# EAGLE design beaglebone_rotor_control_cape (EAGLE 6.5.0)

## Sheet 1 of 7
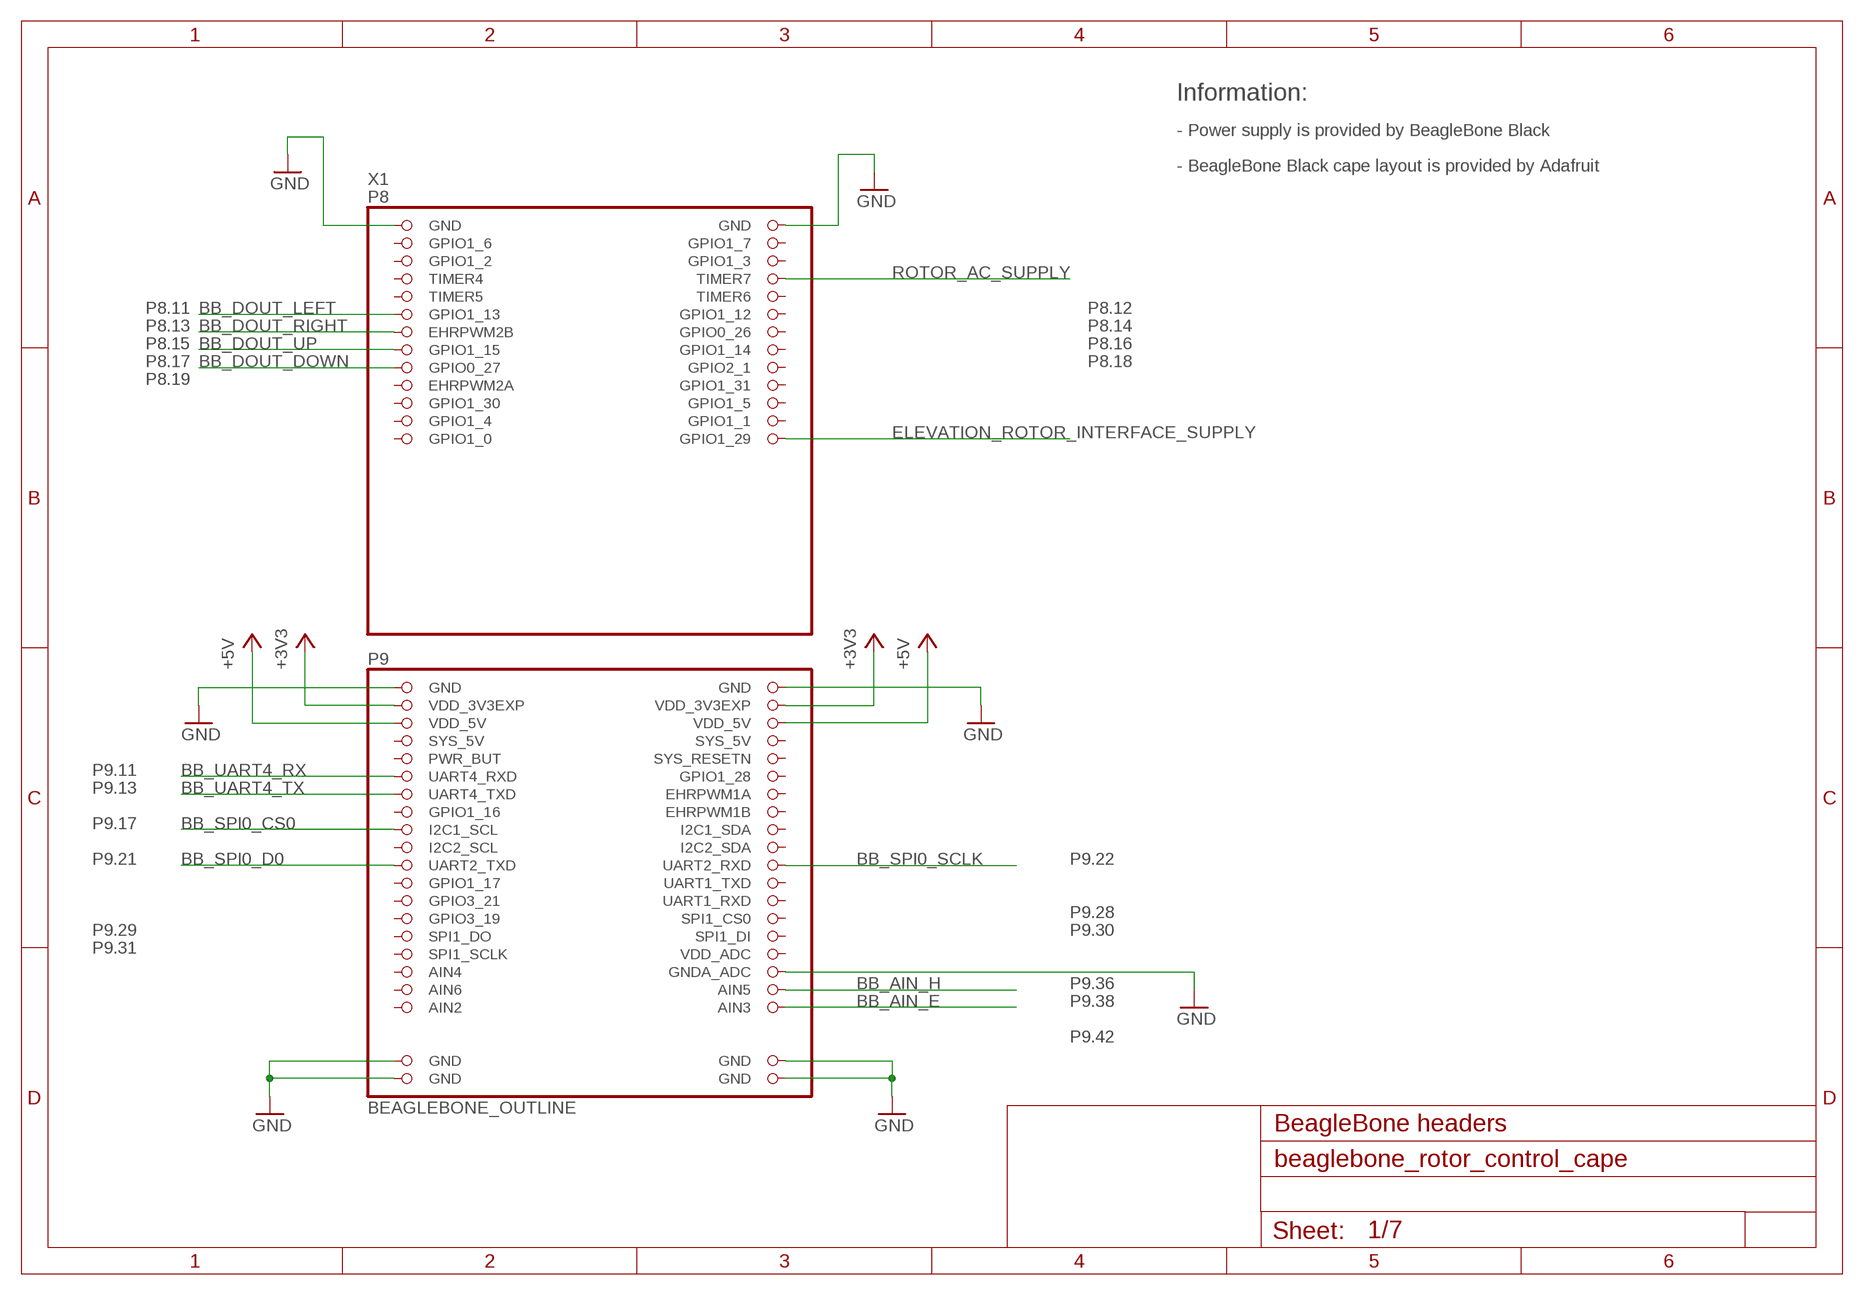
[diagram p0: schematic, sheet 1]

### Parts
X1  BEAGLEBONE_OUTLINE  [BEAGLEBONE_SHIELD]

### Nets
+3V3: X1.49(VDD_3V3EXP) X1.50(VDD_3V3EXP) ; also sheet 2,7
+5V: X1.51(VDD_5V) X1.52(VDD_5V) ; also sheet 2,3,5,6
BB_AIN_E: X1.84(AIN3) ; also sheet 3
BB_AIN_H: X1.82(AIN5) ; also sheet 2
BB_DOUT_DOWN: X1.17(GPIO0_27) ; also sheet 3
BB_DOUT_LEFT: X1.11(GPIO1_13) ; also sheet 2
BB_DOUT_RIGHT: X1.13(EHRPWM2B) ; also sheet 2
BB_DOUT_UP: X1.15(GPIO1_15) ; also sheet 3
BB_SPI0_CS0: X1.63(I2C1_SCL) ; also sheet 2
BB_SPI0_D0: X1.67(UART2_TXD) ; also sheet 2
BB_SPI0_SCLK: X1.68(UART2_RXD) ; also sheet 2
BB_UART4_RX: X1.57(UART4_RXD) ; also sheet 7
BB_UART4_TX: X1.59(UART4_TXD) ; also sheet 7
ELEVATION_ROTOR_INTERFACE_SUPPLY: X1.26(GPIO1_29) ; also sheet 6
GND: X1.1(GND) X1.2(GND) X1.47(GND) X1.48(GND) X1.80(GNDA_ADC) X1.89(GND) X1.90(GND) X1.91(GND) X1.92(GND) ; also sheet 2,3,4,5,6,7
ROTOR_AC_SUPPLY: X1.8(TIMER7) ; also sheet 5
Unconnected: X1.3(GPIO1_6) X1.4(GPIO1_7) X1.5(GPIO1_2) X1.6(GPIO1_3) X1.7(TIMER4) X1.9(TIMER5) X1.10(TIMER6) X1.12(GPIO1_12) X1.14(GPIO0_26) X1.16(GPIO1_14) X1.18(GPIO2_1) X1.19(EHRPWM2A) X1.20(GPIO1_31) X1.21(GPIO1_30) X1.22(GPIO1_5) X1.23(GPIO1_4) X1.24(GPIO1_1) X1.25(GPIO1_0) X1.54(SYS_5V) X1.55(PWR_BUT) X1.56(SYS_RESETN) X1.58(GPIO1_28) X1.60(EHRPWM1A) X1.61(GPIO1_16) X1.62(EHRPWM1B) X1.64(I2C1_SDA) X1.65(I2C2_SCL) X1.66(I2C2_SDA) X1.69(GPIO1_17) X1.70(UART1_TXD) X1.71(GPIO3_21) X1.72(UART1_RXD) X1.73(GPIO3_19) X1.74(SPI1_CS0) X1.75(SPI1_DO) X1.76(SPI1_DI) X1.77(SPI1_SCLK) X1.78(VDD_ADC) X1.79(AIN4) X1.81(AIN6) X1.83(AIN2)

### Notes on the sheet
- Information:
- - Power supply is provided by BeagleBone Black
- - BeagleBone Black cape layout is provided by Adafruit
- P8.11 | P8.12
- P8.13 | P8.14
- P8.15 | P8.16
- P8.17 | P8.18
- P8.19
- P9.11
- P9.13
- P9.17
- P9.21 | P9.22
- P9.28
- P9.29 | P9.30
- P9.31
- P9.36
- P9.38
- P9.42
- BeagleBone headers

## Sheet 2 of 7
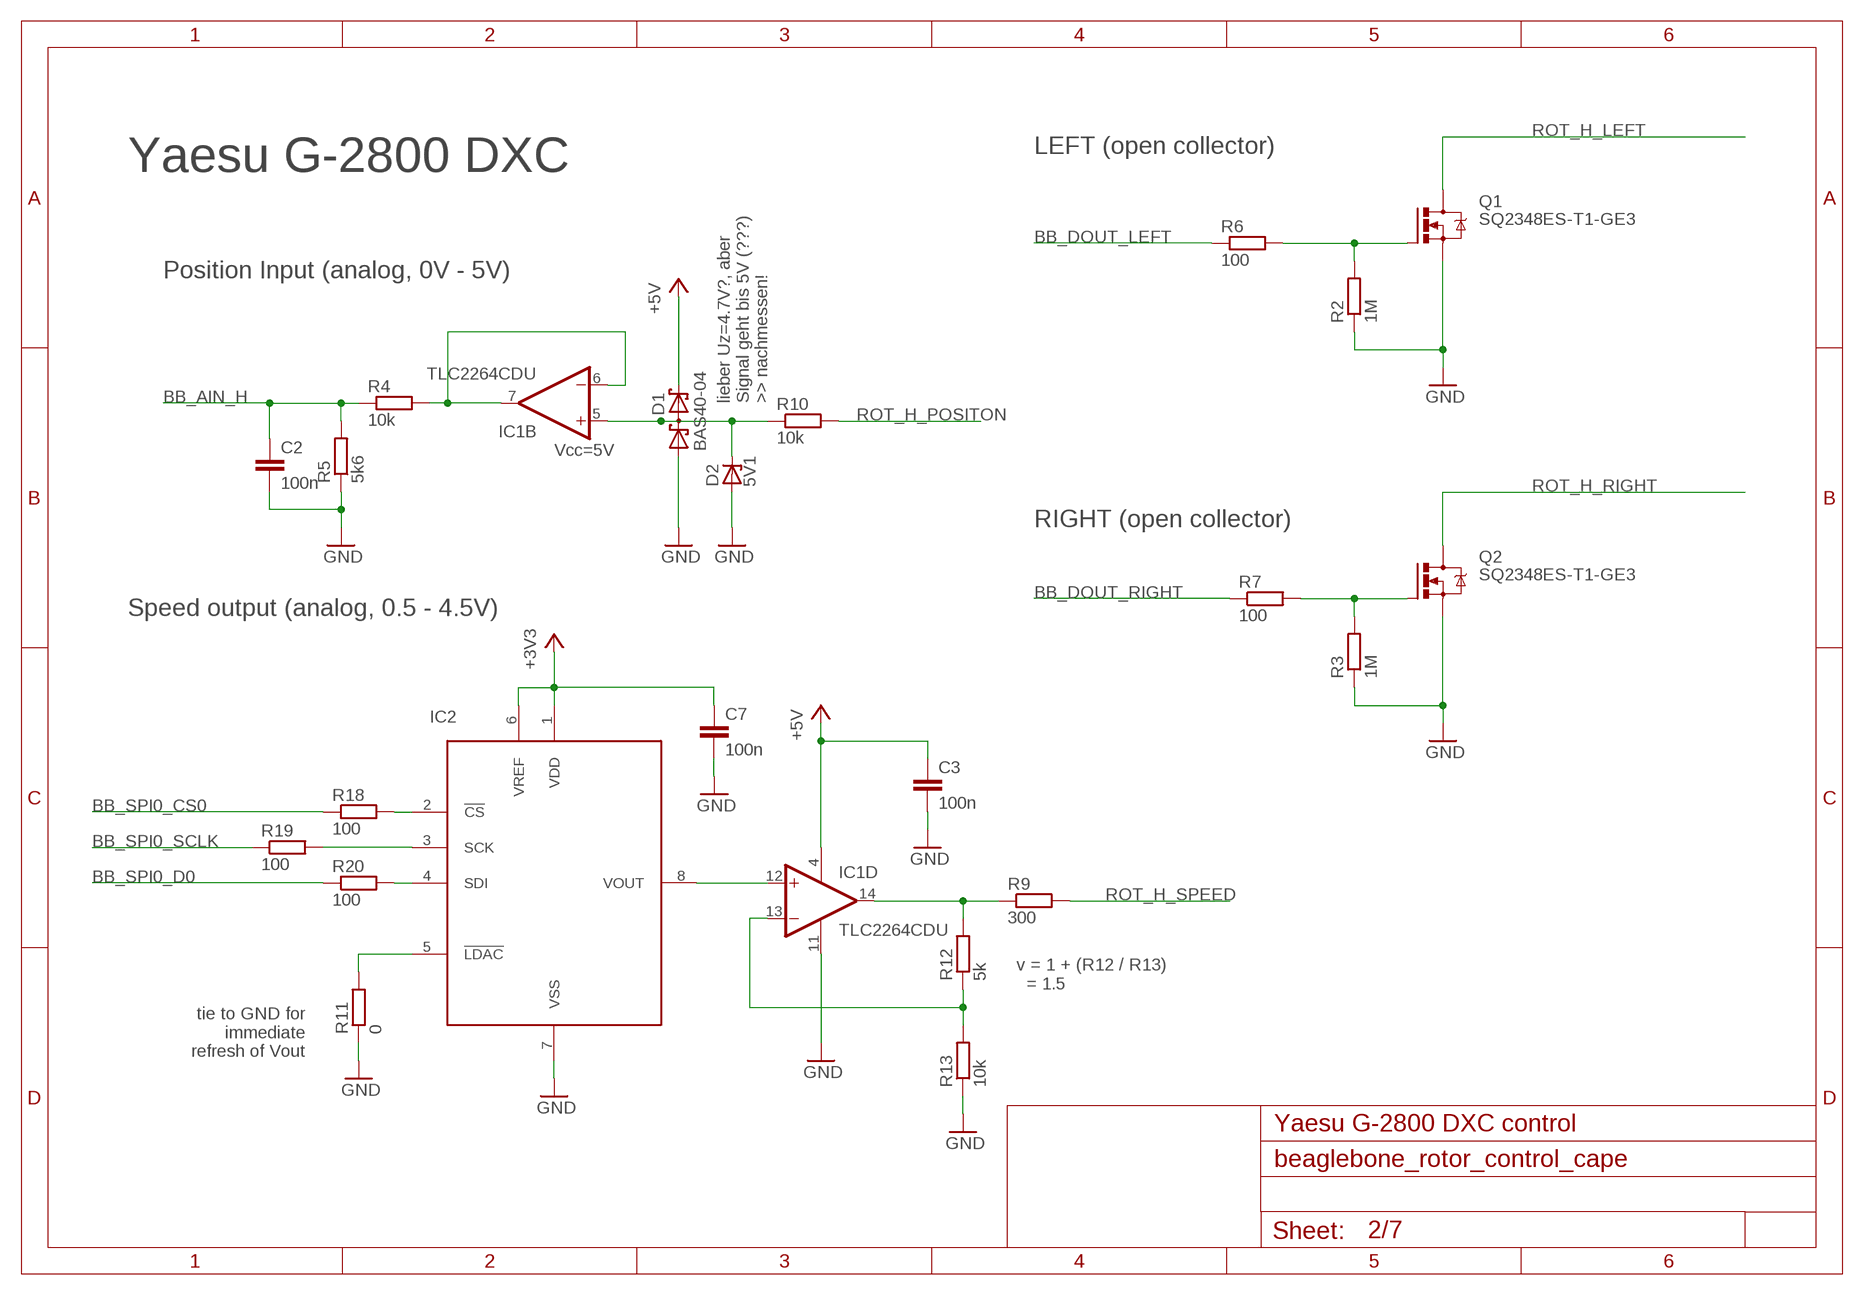
[diagram p1: schematic, sheet 2]

### Parts
C2  100n  C-EUC0603  [C0603]
C3  100n  C-EUC0603  [C0603]
C7  100n  C-EUC0603  [C0603]
D1  BAS40-04  [SOT23]
D2  5V1  ZENER-DIODESOT23  [SOT23]
IC1  TLC2264CDU  [SO14]
IC2  MCP4901  [SO-08]
Q1  SQ2348ES-T1-GE3  [SOT23]
Q2  SQ2348ES-T1-GE3  [SOT23]
R2  1M  R-EU_R0805  [R0805]
R3  1M  R-EU_R0805  [R0805]
R4  10k  R-EU_R0805  [R0805]
R5  5k6  R-EU_R0805  [R0805]
R6  100  R-EU_R0805  [R0805]
R7  100  R-EU_R0805  [R0805]
R9  300  R-EU_R0805  [R0805]
R10  10k  R-EU_R0805  [R0805]
R11  0  R-EU_R0805  [R0805]
R12  5k  R-EU_R0805  [R0805]
R13  10k  R-EU_R0805  [R0805]
R18  100  R-EU_R0805  [R0805]
R19  100  R-EU_R0805  [R0805]
R20  100  R-EU_R0805  [R0805]

### Nets
+3V3: C7.1 IC2.1(VDD) IC2.6(VREF) ; also sheet 1,7
+5V: C3.1 D1.2(C2) IC1.4(P:V+) ; also sheet 1,3,5,6
BB_AIN_H: C2.1 R4.1 R5.2 ; also sheet 1
BB_DOUT_LEFT: R6.1 ; also sheet 1
BB_DOUT_RIGHT: R7.1 ; also sheet 1
BB_SPI0_CS0: R18.1 ; also sheet 1
BB_SPI0_D0: R20.1 ; also sheet 1
BB_SPI0_SCLK: R19.1 ; also sheet 1
GND: C2.2 C3.2 C7.2 D1.1(A1) D2.1(A) IC1.11(P:V-) IC2.7(VSS) Q1.2(S) Q2.2(S) R2.1 R3.1 R5.1 R11.1 R13.1 ; also sheet 1,3,4,5,6,7
N$1: IC1.6(B:-IN) IC1.7(B:OUT) R4.2
N$2: IC1.12(D:+IN) IC2.8(VOUT)
N$3: IC1.14(D:OUT) R9.1 R12.2
N$5: IC1.13(D:-IN) R12.1 R13.2
N$6: IC2.2(!CS) R18.2
N$7: IC2.5(!LDAC) R11.2
N$9: IC2.4(SDI) R20.2
N$10: IC2.3(SCK) R19.2
N$11: Q2.1(G) R3.2 R7.2
N$12: D1.3(C1A2) D2.3(C) IC1.5(B:+IN) R10.1
N$13: Q1.1(G) R2.2 R6.2
ROT_H_LEFT: Q1.3(D) ; also sheet 4
ROT_H_POSITON: R10.2 ; also sheet 4
ROT_H_RIGHT: Q2.3(D) ; also sheet 4
ROT_H_SPEED: R9.2 ; also sheet 4
Unconnected: IC1.1(A:OUT) IC1.2(A:-IN) IC1.3(A:+IN) IC1.8(C:OUT) IC1.9(C:-IN) IC1.10(C:+IN)

### Notes on the sheet
- LEFT (open collector)
- Yaesu G-2800 DXC
- Position Input (analog, 0V - 5V)
- lieber Uz=4.7V?, aber
  Signal geht bis 5V (???)
  >> nachmessen!
- Vcc=5V
- RIGHT (open collector)
- Speed output (analog, 0.5 - 4.5V)
- v = 1 + (R12 / R13)
    = 1.5
- tie to GND for
  immediate
  refresh of Vout
- Yaesu G-2800 DXC control

## Sheet 3 of 7
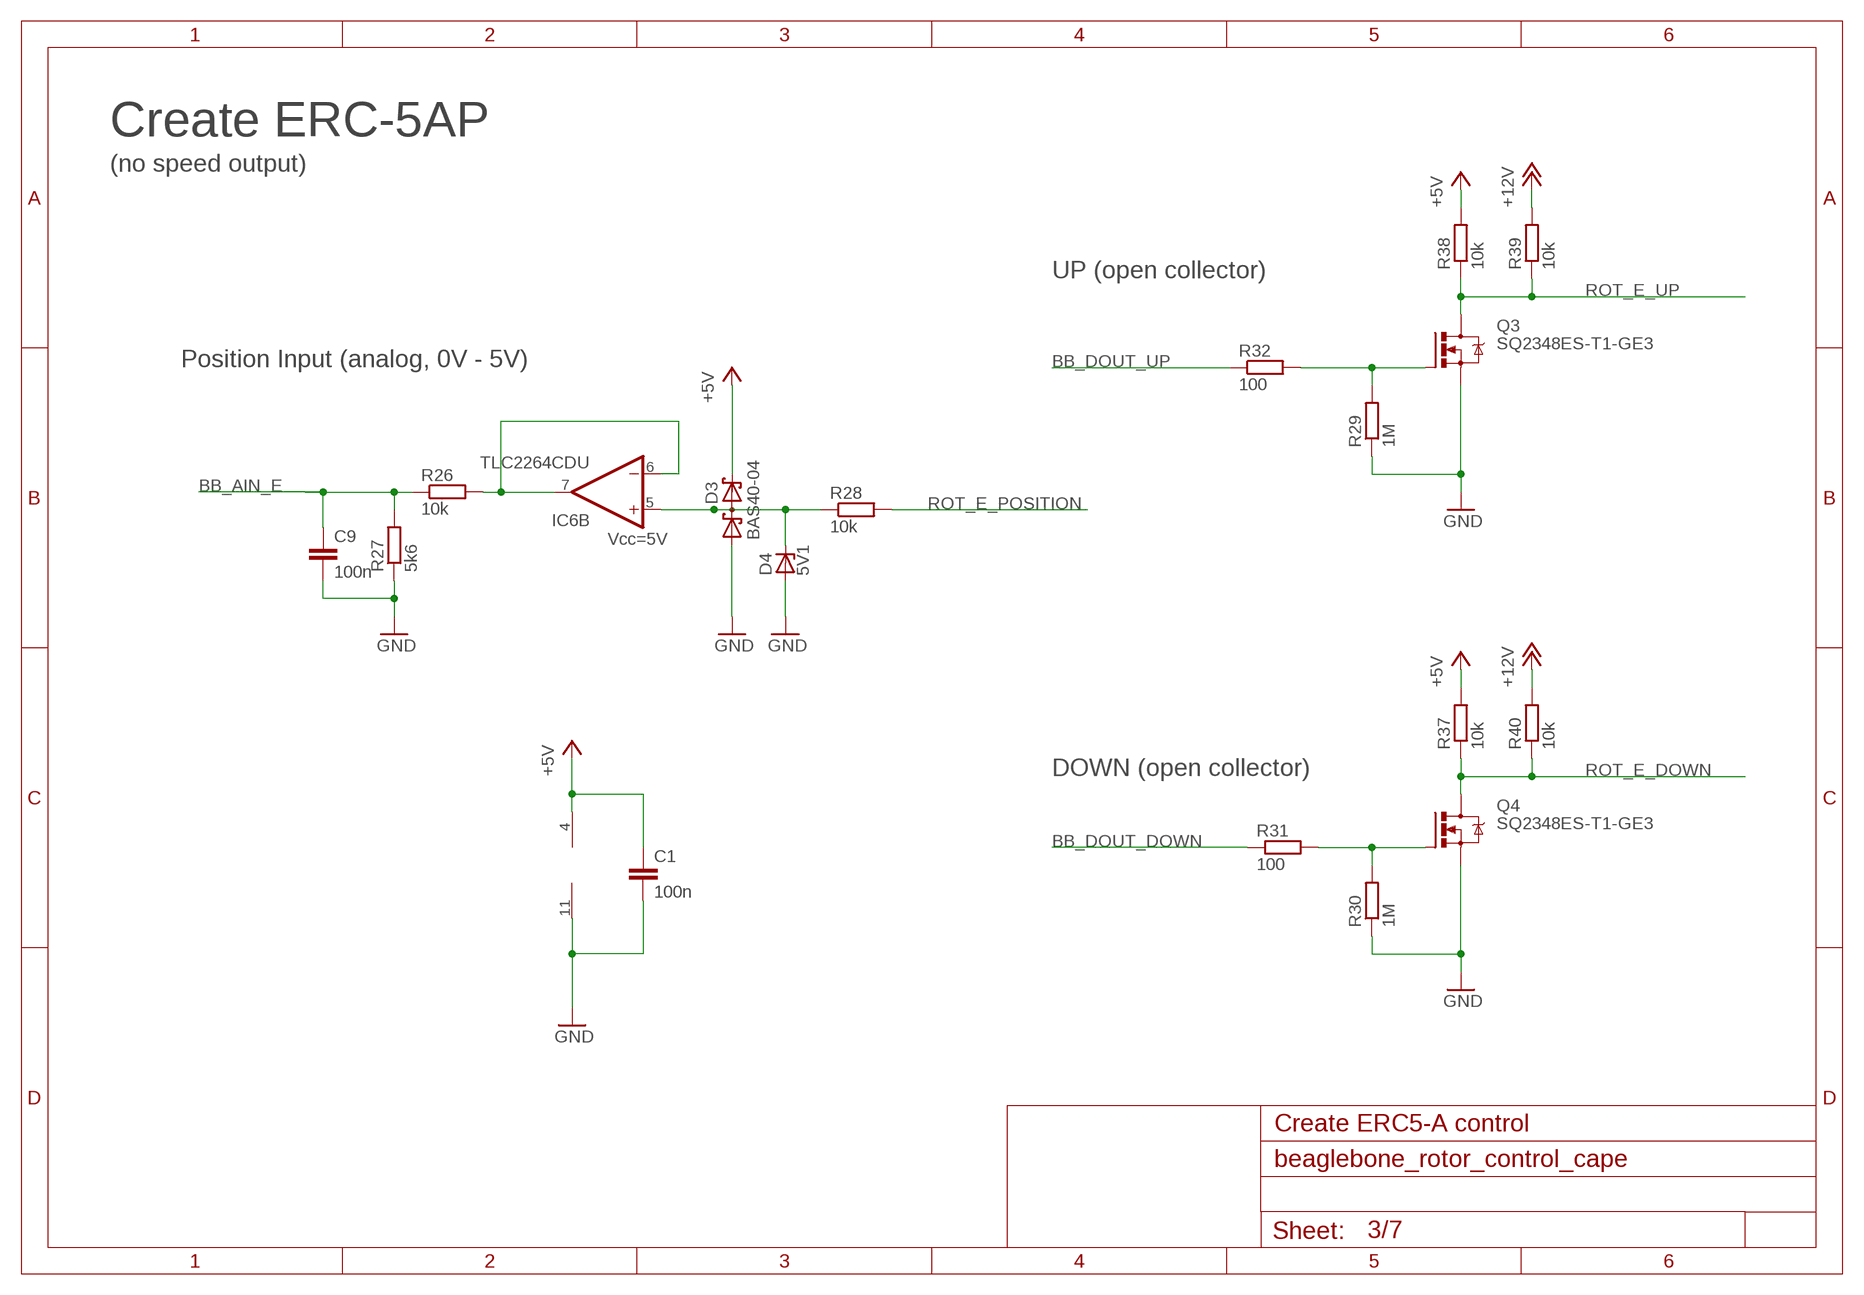
[diagram p2: schematic, sheet 3]

### Parts
C1  100n  C-EUC0603  [C0603]
C9  100n  C-EUC0603  [C0603]
D3  BAS40-04  [SOT23]
D4  5V1  ZENER-DIODESOT23  [SOT23]
IC6  TLC2264CDU  [SO14]
Q3  SQ2348ES-T1-GE3  [SOT23]
Q4  SQ2348ES-T1-GE3  [SOT23]
R26  10k  R-EU_R0805  [R0805]
R27  5k6  R-EU_R0805  [R0805]
R28  10k  R-EU_R0805  [R0805]
R29  1M  R-EU_R0805  [R0805]
R30  1M  R-EU_R0805  [R0805]
R31  100  R-EU_R0805  [R0805]
R32  100  R-EU_R0805  [R0805]
R37  10k  R-EU_R0805  [R0805]
R38  10k  R-EU_R0805  [R0805]
R39  10k  R-EU_R0805  [R0805]
R40  10k  R-EU_R0805  [R0805]

### Nets
+5V: C1.1 D3.2(C2) IC6.4(P:V+) R37.2 R38.2 ; also sheet 1,2,5,6
+12V: R39.2 R40.2 ; also sheet 4,6
BB_AIN_E: C9.1 R26.1 R27.2 ; also sheet 1
BB_DOUT_DOWN: R31.1 ; also sheet 1
BB_DOUT_UP: R32.1 ; also sheet 1
GND: C1.2 C9.2 D3.1(A1) D4.1(A) IC6.11(P:V-) Q3.2(S) Q4.2(S) R27.1 R29.1 R30.1 ; also sheet 1,2,4,5,6,7
N$35: IC6.6(B:-IN) IC6.7(B:OUT) R26.2
N$36: D3.3(C1A2) D4.3(C) IC6.5(B:+IN) R28.1
N$38: Q3.1(G) R29.2 R32.2
N$39: Q4.1(G) R30.2 R31.2
ROT_E_DOWN: Q4.3(D) R37.1 R40.1 ; also sheet 4
ROT_E_POSITION: R28.2 ; also sheet 4
ROT_E_UP: Q3.3(D) R38.1 R39.1 ; also sheet 4
Unconnected: IC6.1(A:OUT) IC6.2(A:-IN) IC6.3(A:+IN) IC6.8(C:OUT) IC6.9(C:-IN) IC6.10(C:+IN) IC6.12(D:+IN) IC6.13(D:-IN) IC6.14(D:OUT)

### Notes on the sheet
- Create ERC-5AP
- (no speed output)
- UP (open collector)
- Position Input (analog, 0V - 5V)
- Vcc=5V
- DOWN (open collector)
- Create ERC5-A control

## Sheet 4 of 7
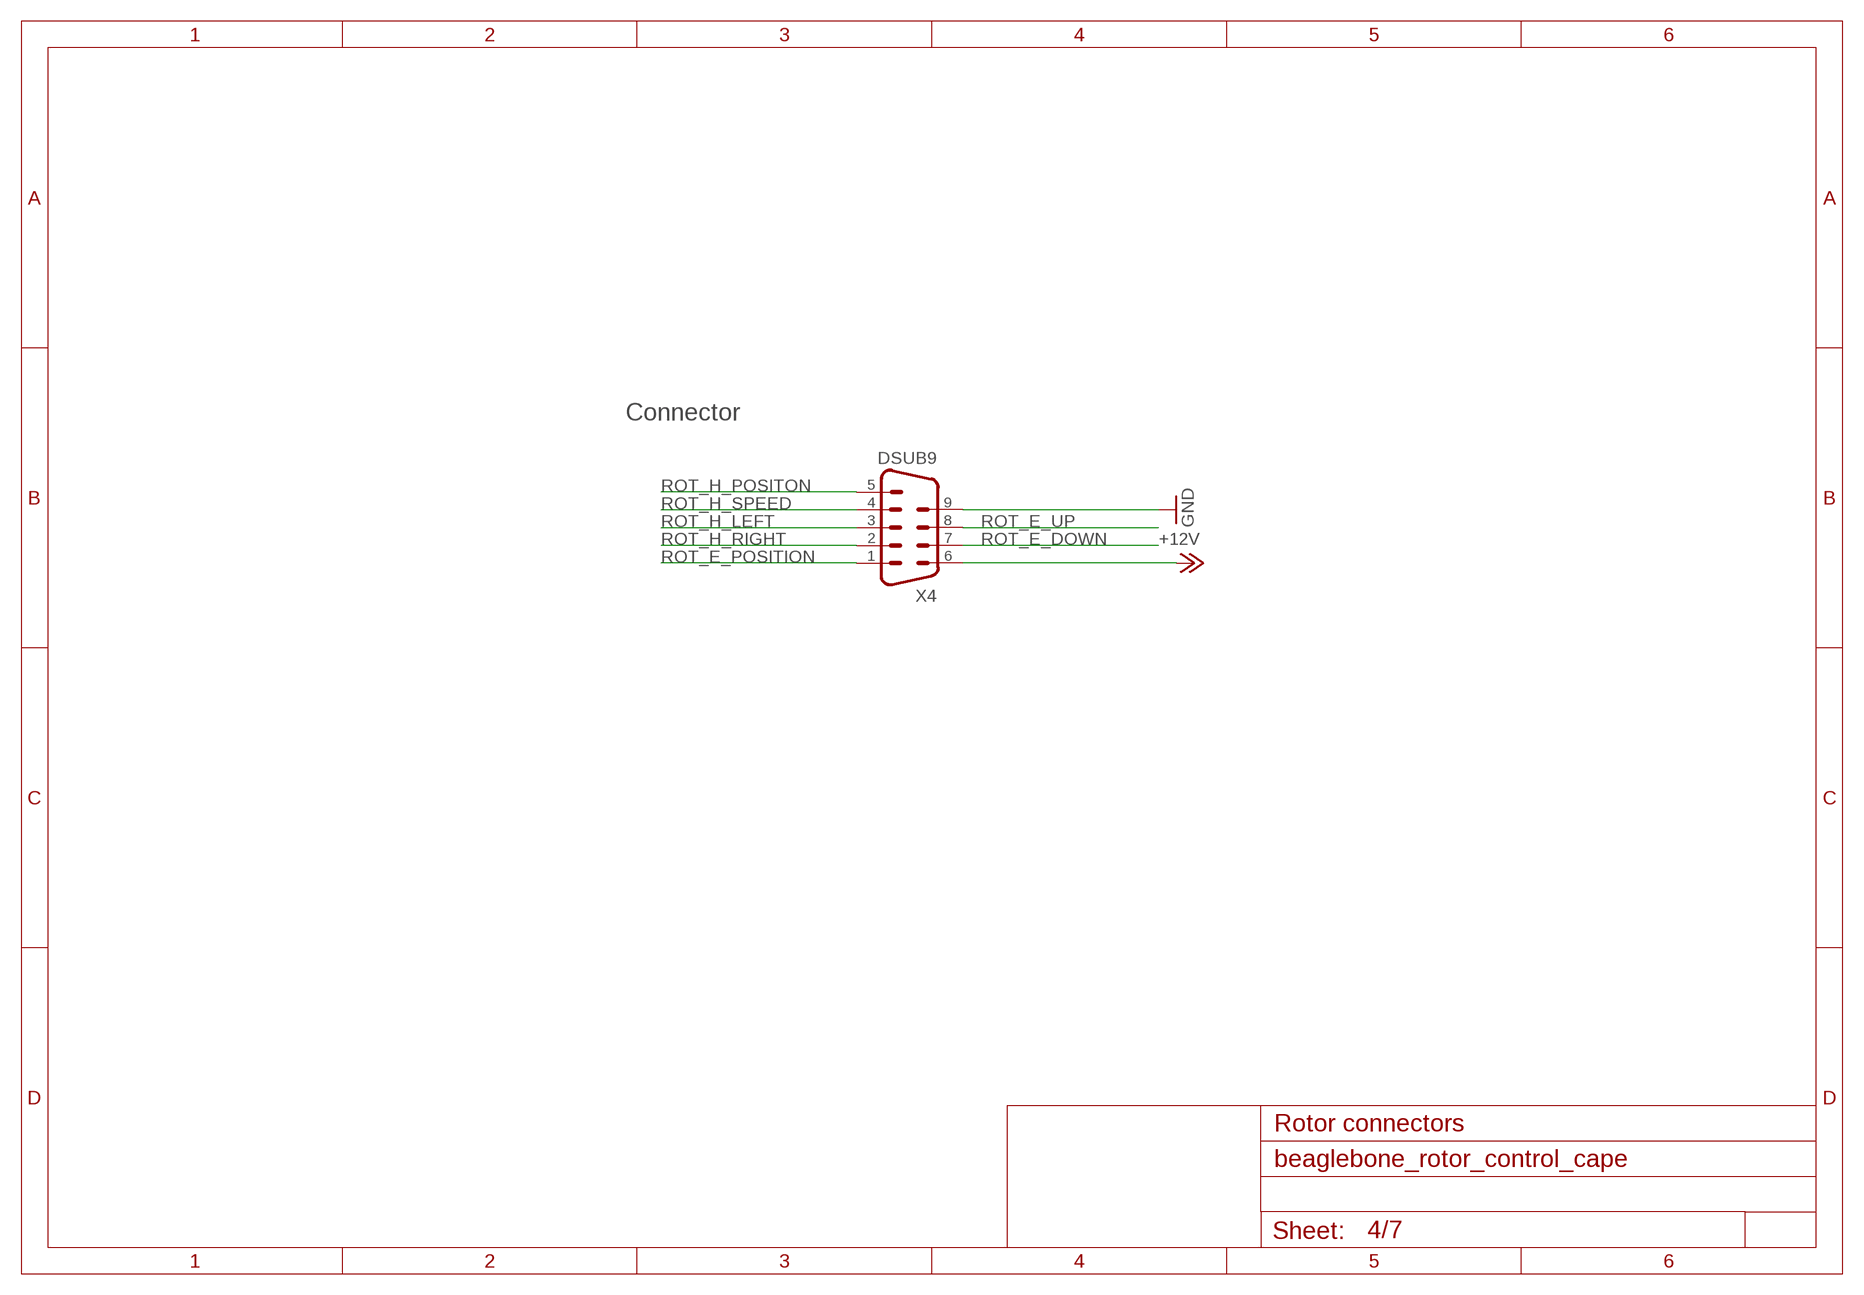
[diagram p3: schematic, sheet 4]

### Parts
X4  DSUB9  [DSUB9]

### Nets
+12V: X4.6 ; also sheet 3,6
GND: X4.9 ; also sheet 1,2,3,5,6,7
ROT_E_DOWN: X4.7 ; also sheet 3
ROT_E_POSITION: X4.1 ; also sheet 3
ROT_E_UP: X4.8 ; also sheet 3
ROT_H_LEFT: X4.3 ; also sheet 2
ROT_H_POSITON: X4.5 ; also sheet 2
ROT_H_RIGHT: X4.2 ; also sheet 2
ROT_H_SPEED: X4.4 ; also sheet 2

### Notes on the sheet
- Connector
- Rotor connectors

## Sheet 5 of 7
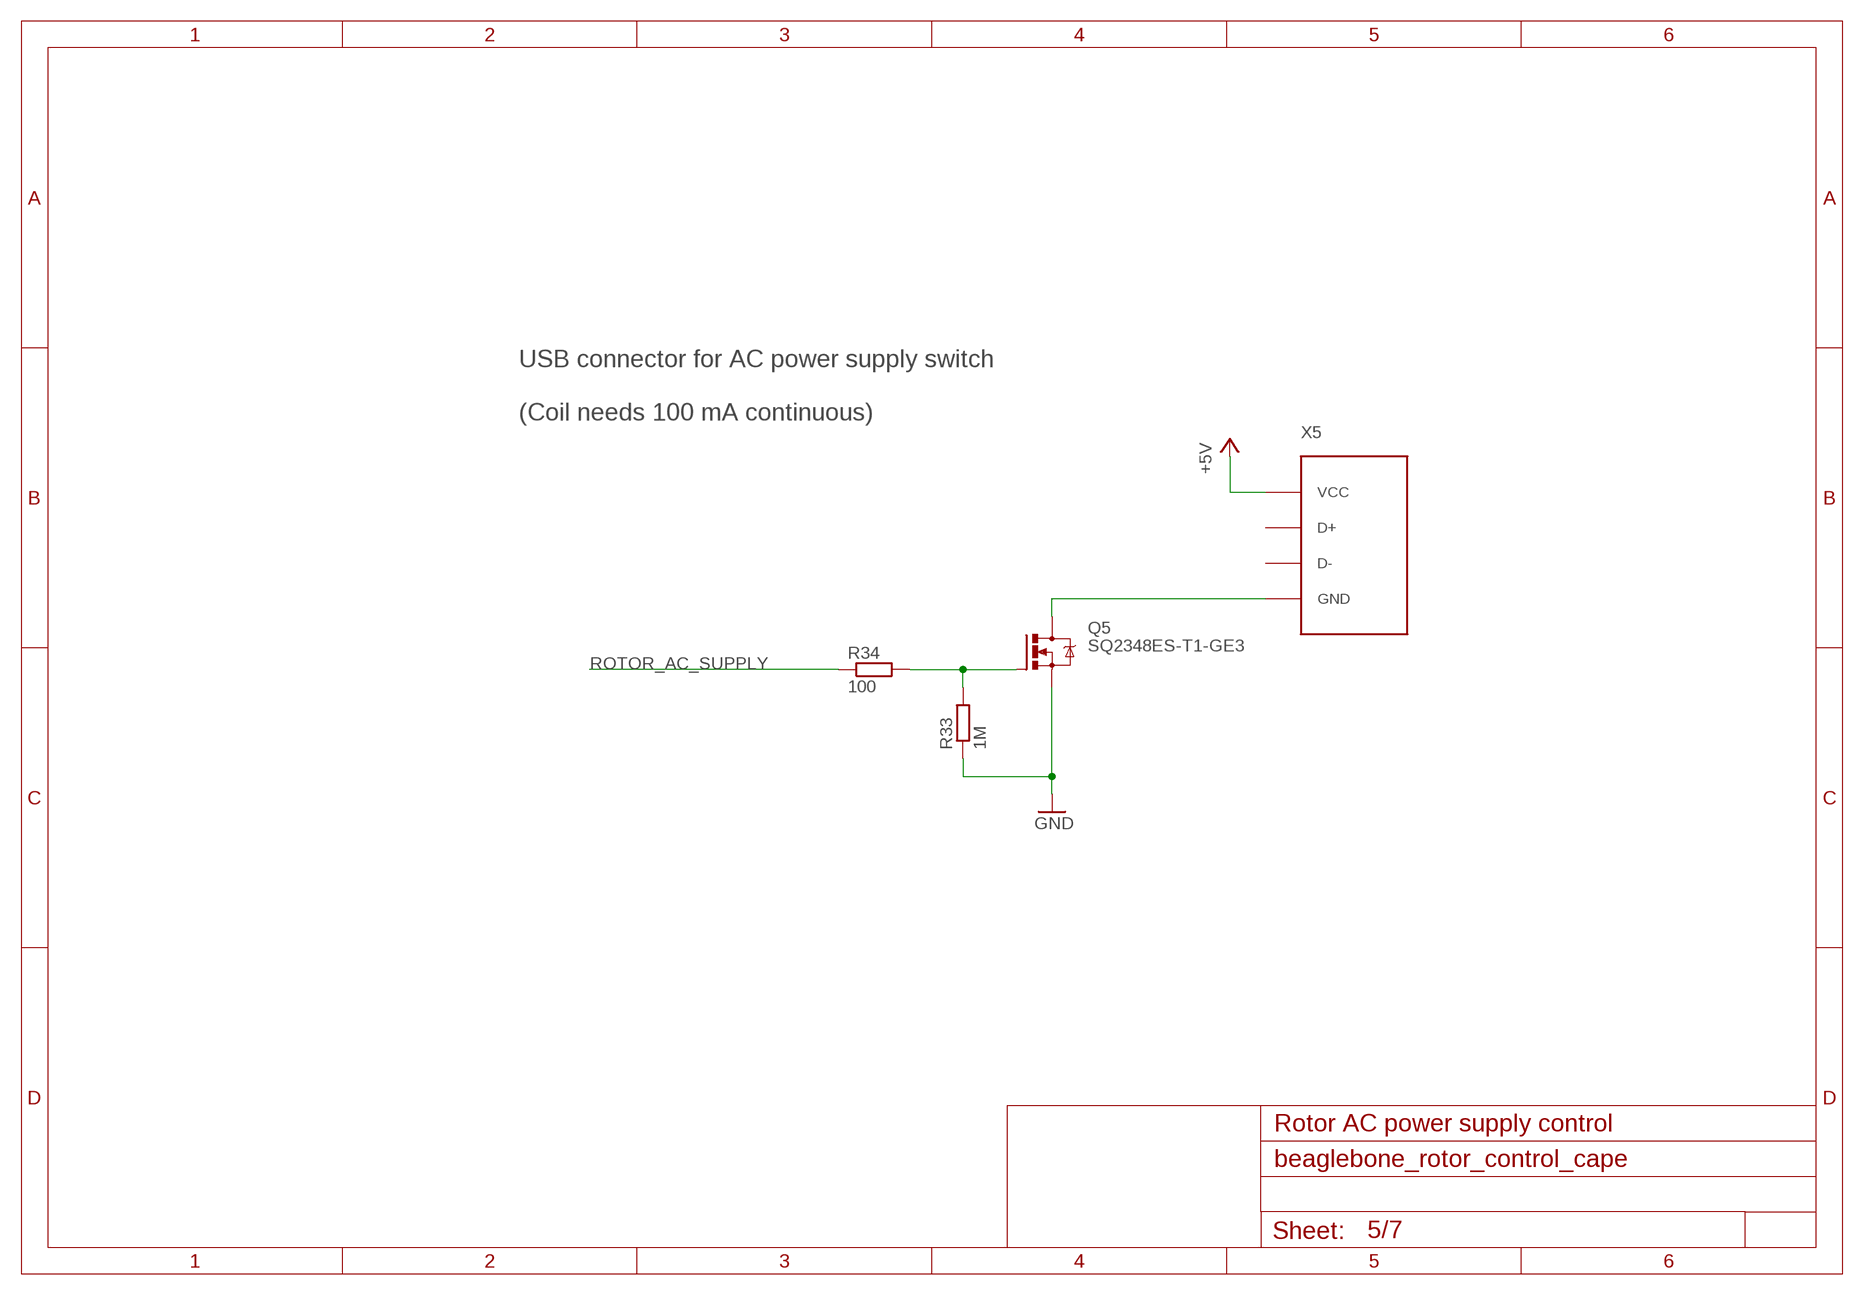
[diagram p4: schematic, sheet 5]

### Parts
Q5  SQ2348ES-T1-GE3  [SOT23]
R33  1M  R-EU_R0805  [R0805]
R34  100  R-EU_R0805  [R0805]
X5  USBDEV  [USB]

### Nets
+5V: X5.1-VCC(VCC) ; also sheet 1,2,3,6
GND: Q5.2(S) R33.1 ; also sheet 1,2,3,4,6,7
N$14: Q5.3(D) X5.GND
N$23: Q5.1(G) R33.2 R34.2
ROTOR_AC_SUPPLY: R34.1 ; also sheet 1
Unconnected: X5.2-D+(D+) X5.2-D-(D-)

### Notes on the sheet
- USB connector for AC power supply switch
- (Coil needs 100 mA continuous)
- Rotor AC power supply control

## Sheet 6 of 7
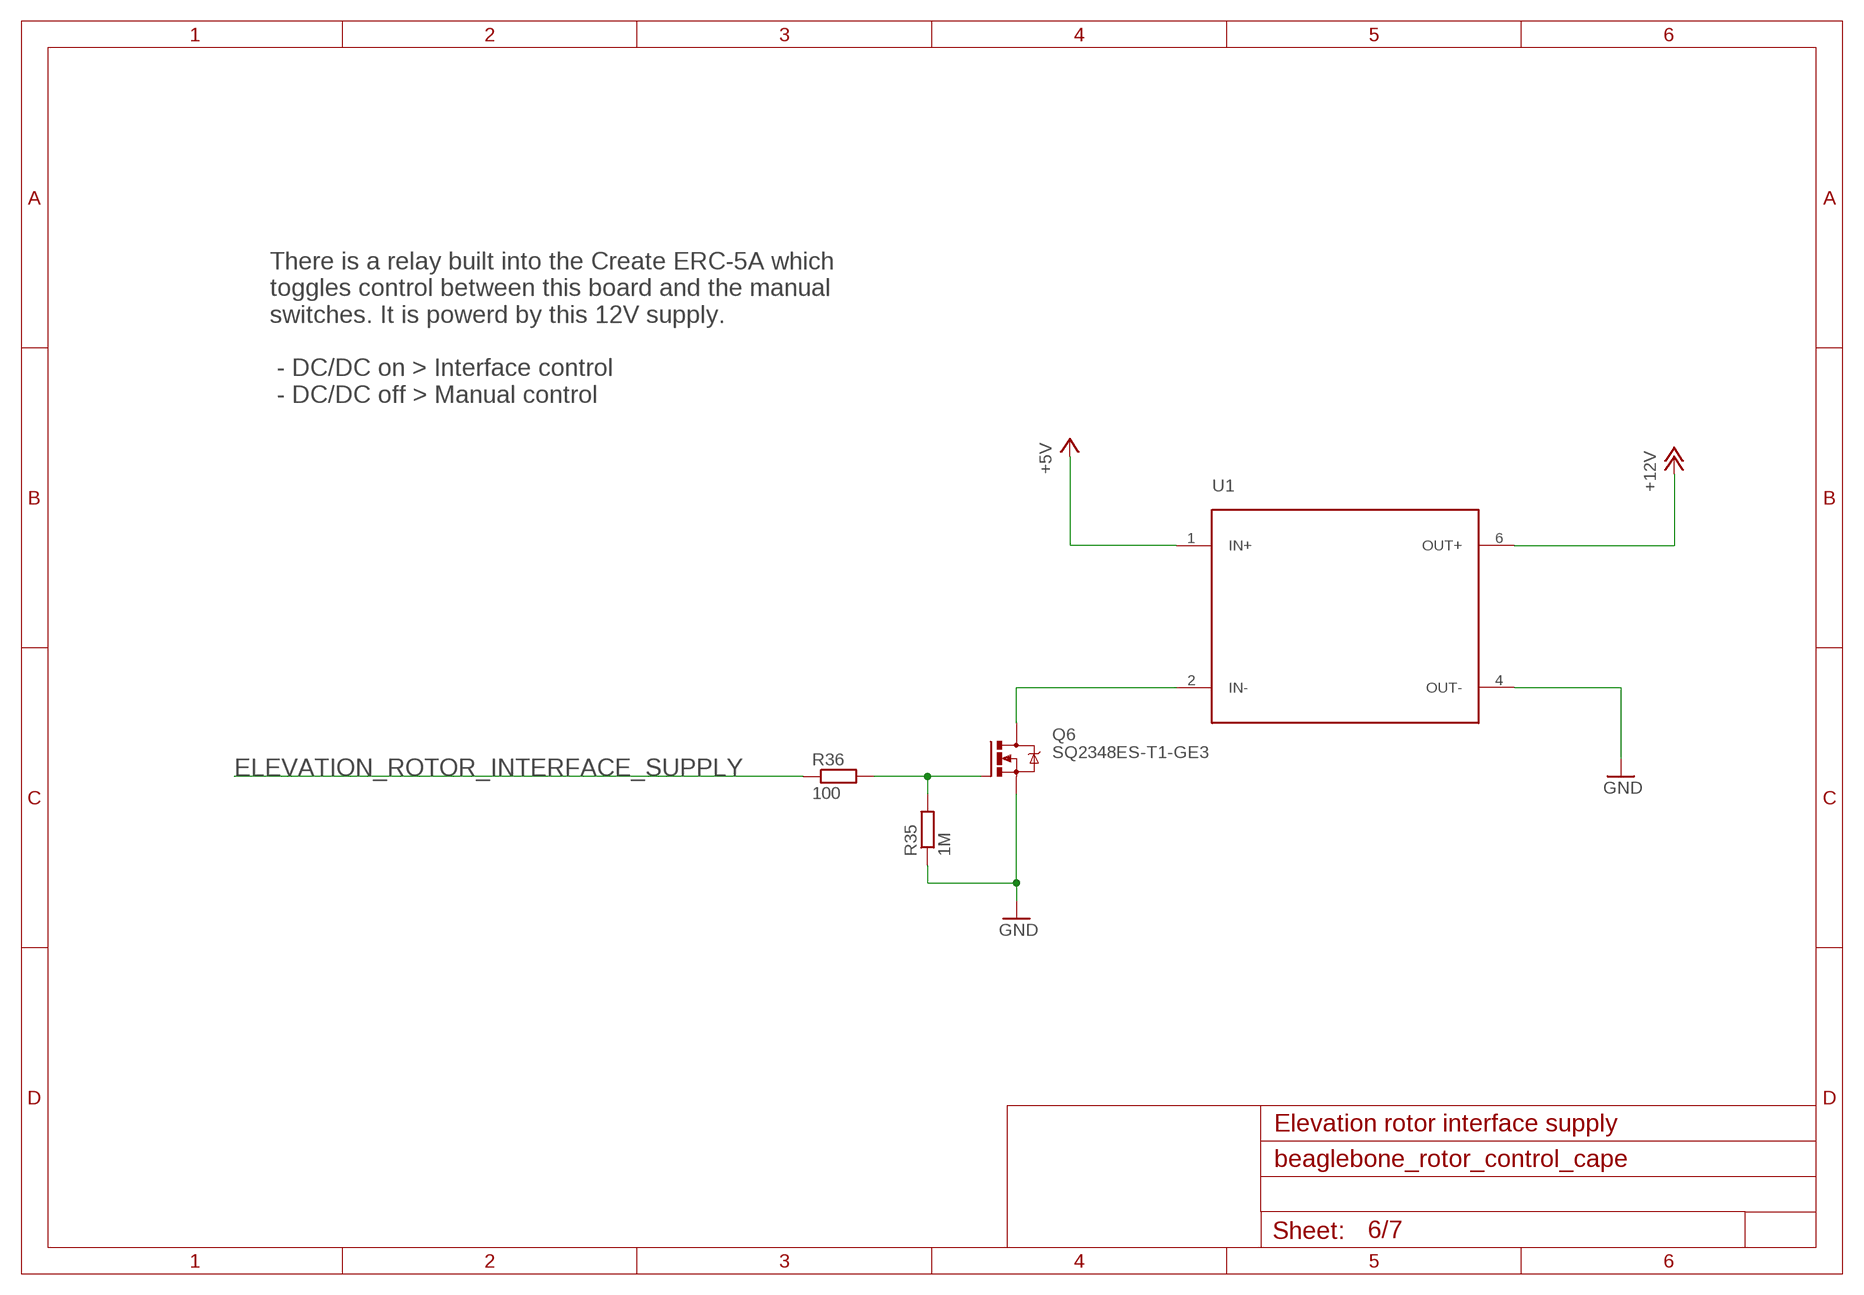
[diagram p5: schematic, sheet 6]

### Parts
Q6  SQ2348ES-T1-GE3  [SOT23]
R35  1M  R-EU_R0805  [R0805]
R36  100  R-EU_R0805  [R0805]
U1  TMH0512S  [SIP]

### Nets
+5V: U1.1(IN+) ; also sheet 1,2,3,5
+12V: U1.6(OUT+) ; also sheet 3,4
ELEVATION_ROTOR_INTERFACE_SUPPLY: R36.1 ; also sheet 1
GND: Q6.2(S) R35.1 U1.4(OUT-) ; also sheet 1,2,3,4,5,7
N$34: Q6.1(G) R35.2 R36.2
N$37: Q6.3(D) U1.2(IN-)

### Notes on the sheet
- There is a relay built into the Create ERC-5A which
  toggles control between this board and the manual
  switches. It is powerd by this 12V supply.
  
   - DC/DC on > Interface control
   - DC/DC off > Manual control
- Elevation rotor interface supply

## Sheet 7 of 7
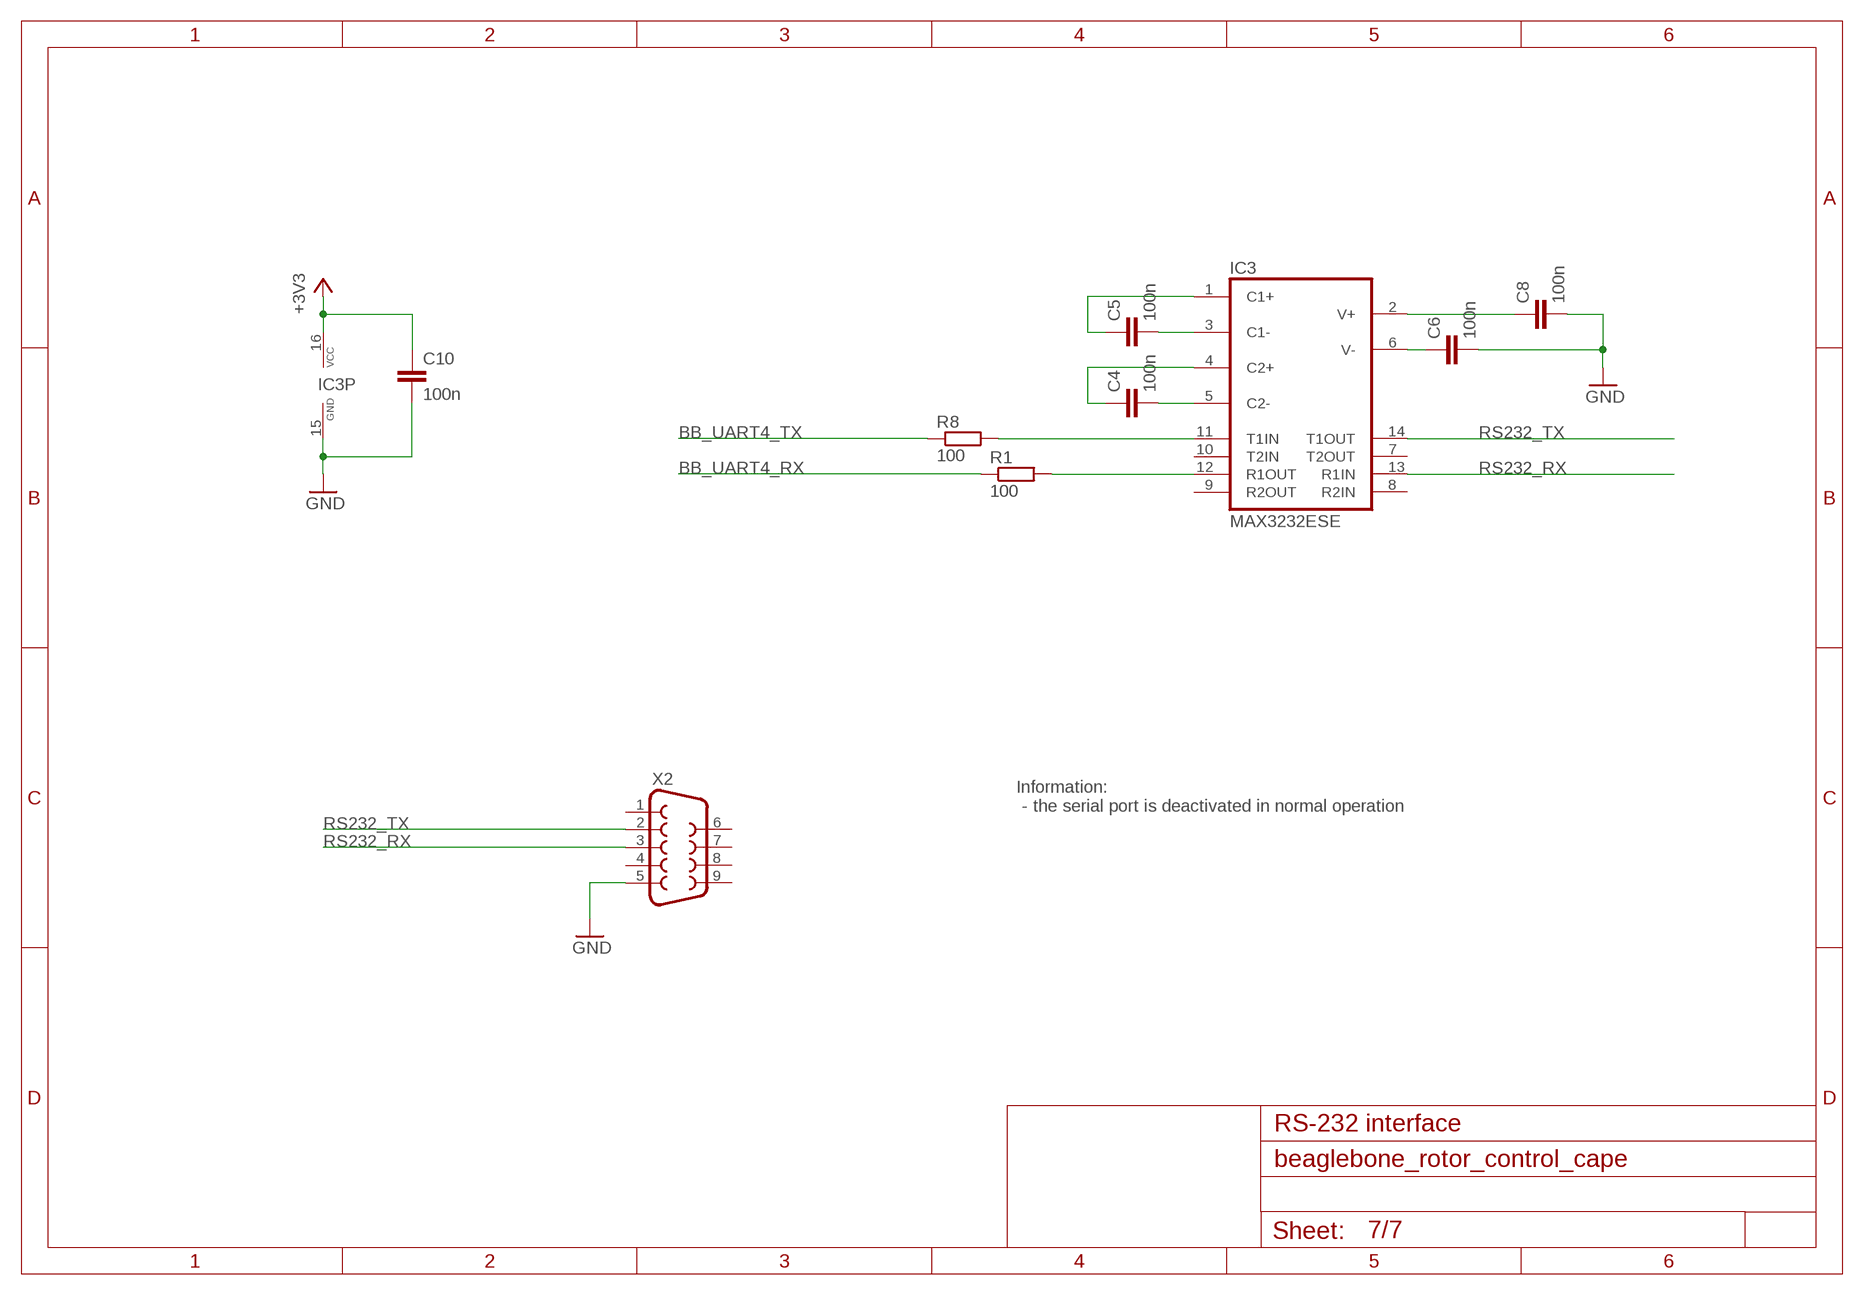
[diagram p6: schematic, sheet 7]

### Parts
C4  100n  C-EUC0603  [C0603]
C5  100n  C-EUC0603  [C0603]
C6  100n  C-EUC0603  [C0603]
C8  100n  C-EUC0603  [C0603]
C10  100n  C-EUC0603  [C0603]
IC3  MAX3232ESE  [SO16]
R1  100  R-EU_R0805  [R0805]
R8  100  R-EU_R0805  [R0805]
X2  F09VP  [F09VP]

### Nets
+3V3: C10.1 IC3.16(VCC) ; also sheet 1,2
BB_UART4_RX: R1.1 ; also sheet 1
BB_UART4_TX: R8.1 ; also sheet 1
GND: C6.2 C8.2 C10.2 IC3.15(GND) X2.5 ; also sheet 1,2,3,4,5,6
N$16: C4.1 IC3.4(C2+)
N$17: C4.2 IC3.5(C2-)
N$18: C5.2 IC3.3(C1-)
N$19: C5.1 IC3.1(C1+)
N$20: C6.1 IC3.6(V-)
N$21: C8.1 IC3.2(V+)
N$22: IC3.11(T1IN) R8.2
N$25: IC3.12(R1OUT) R1.2
RS232_RX: IC3.13(R1IN) X2.3
RS232_TX: IC3.14(T1OUT) X2.2
Unconnected: IC3.7(T2OUT) IC3.8(R2IN) IC3.9(R2OUT) IC3.10(T2IN) X2.1 X2.4 X2.6 X2.7 X2.8 X2.9

### Notes on the sheet
- Information:
   - the serial port is deactivated in normal operation
- RS-232 interface

## Power pins joined to a net without a drawn wire
SYS_5V: X1.53(SYS_5V)

## Library data of the parts
C1-C10 = rcl:C-EU: CAPACITOR, European symbol
D1 D3 = diode:BAS40-04: Silicon Schottky Diodes General-purpose diode for high-speed switching
D2 D4 = diode:ZENER-DIODE: Z-Diode
IC1 IC6 = ti-tlc2264cd:TLC2264CD: Quad Operational Amplifier
IC2 = microchip_mcp4901:MCP4901: 8-Bit Voltage Output Digital-to-Analog Converter with SPI Interface
IC3 = maxim:MAX3232*: True RS-232 Transceivers 3.0V to 5.5V, Low-Power up to 1Mbps, Using Four 0.1µF External Capacitors Source: http://pdfserv.maxim-ic.com/en/ds/MAX3222-MAX3241.pdf; MF: MAXIM; MPN: MAX3232ESE; OC_FARNELL: 9725539; OC_NEWARK: 79C3880
Q1-Q6 = vishay_sq2348eS-t1-ge3:SQ2348ES-T1-GE3: Automotive N-Channel MOSFET
R1-R13 R18-R20 R26-R40 = rcl:R-EU_: RESISTOR, European symbol
U1 = traco_dcdc:TMH0512S: DC/DC Converter - TMH Series, 2 Watt
X1 = beaglebone:BEAGLEBONE_OUTLINE: BeagleBone Black Reference Layout Source: Adafruit (Github <https://github.com/adafruit/Adafruit-Eagle-Library>) Should match A3 pinout - but not completely tested
X2 = con-subd:F09: SUB-D; OC_FARNELL: unknown; OC_NEWARK: unknown
X4 = con-te-dsub:DSUB9: 3-1634222-2
X5 = con-usbbuchse:USBDEV: USB Buchse - Typ A, abgewinkelt http://www.conrad.de/ce/de/product/738805/USB-Steckverbinder-20-Buchse-Einbau-2410-02-Einbaukupplung-Typ-A-abgewinkelt-Lumberg-Inhalt-1-St?

## Board
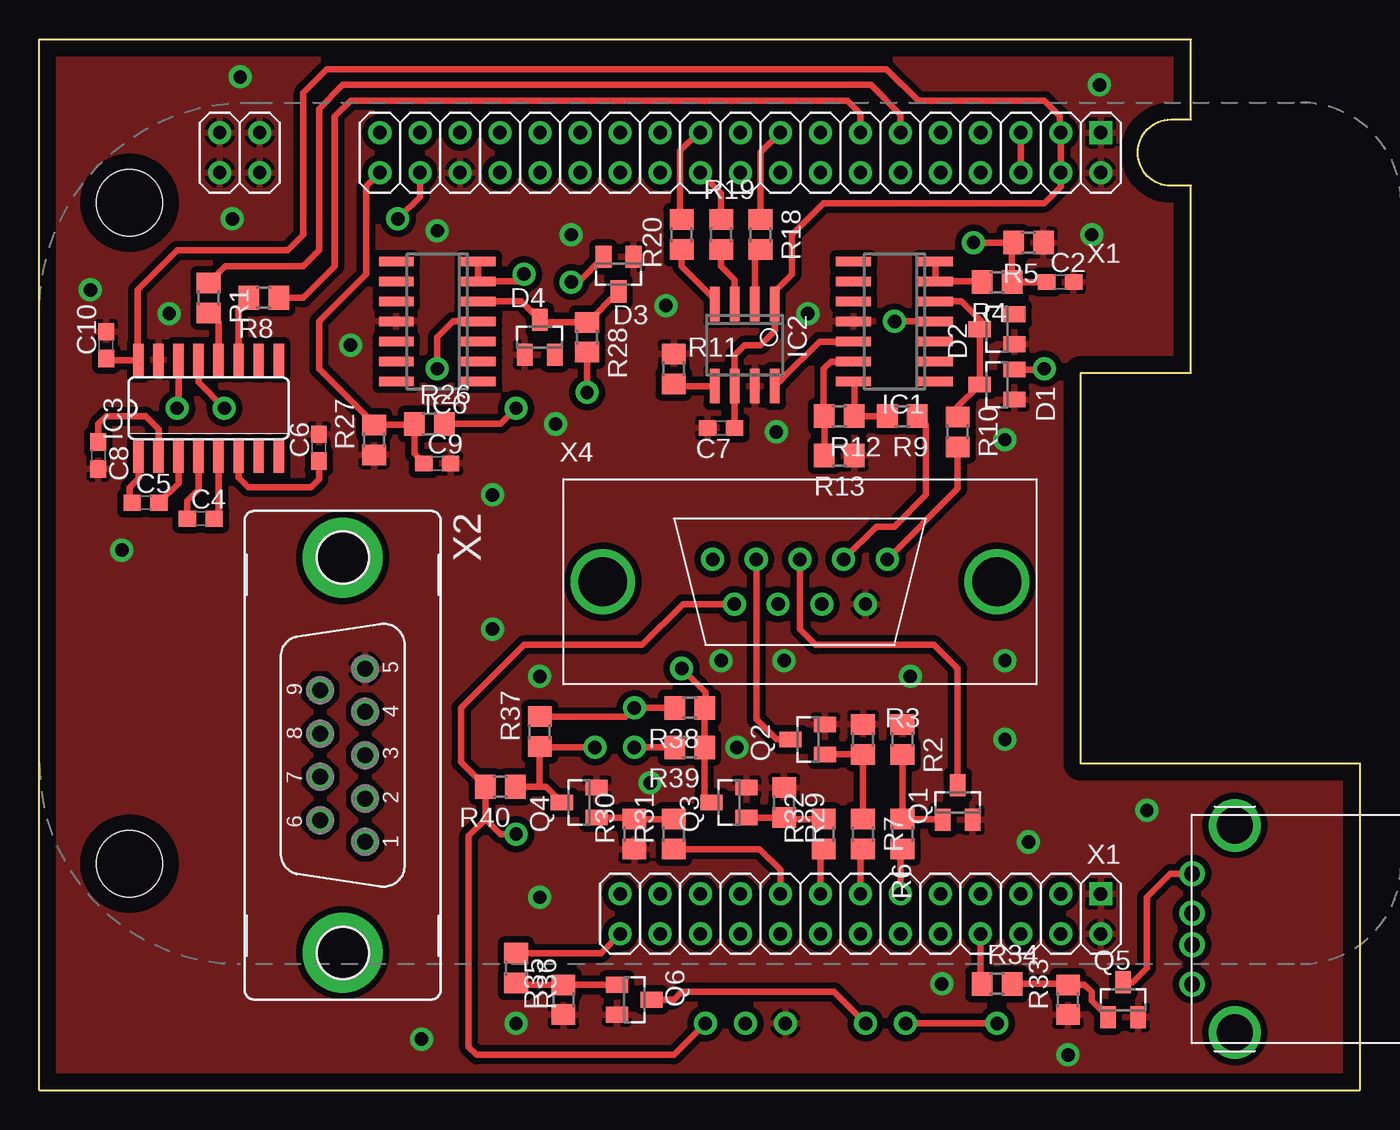
[diagram p7: board, top side]
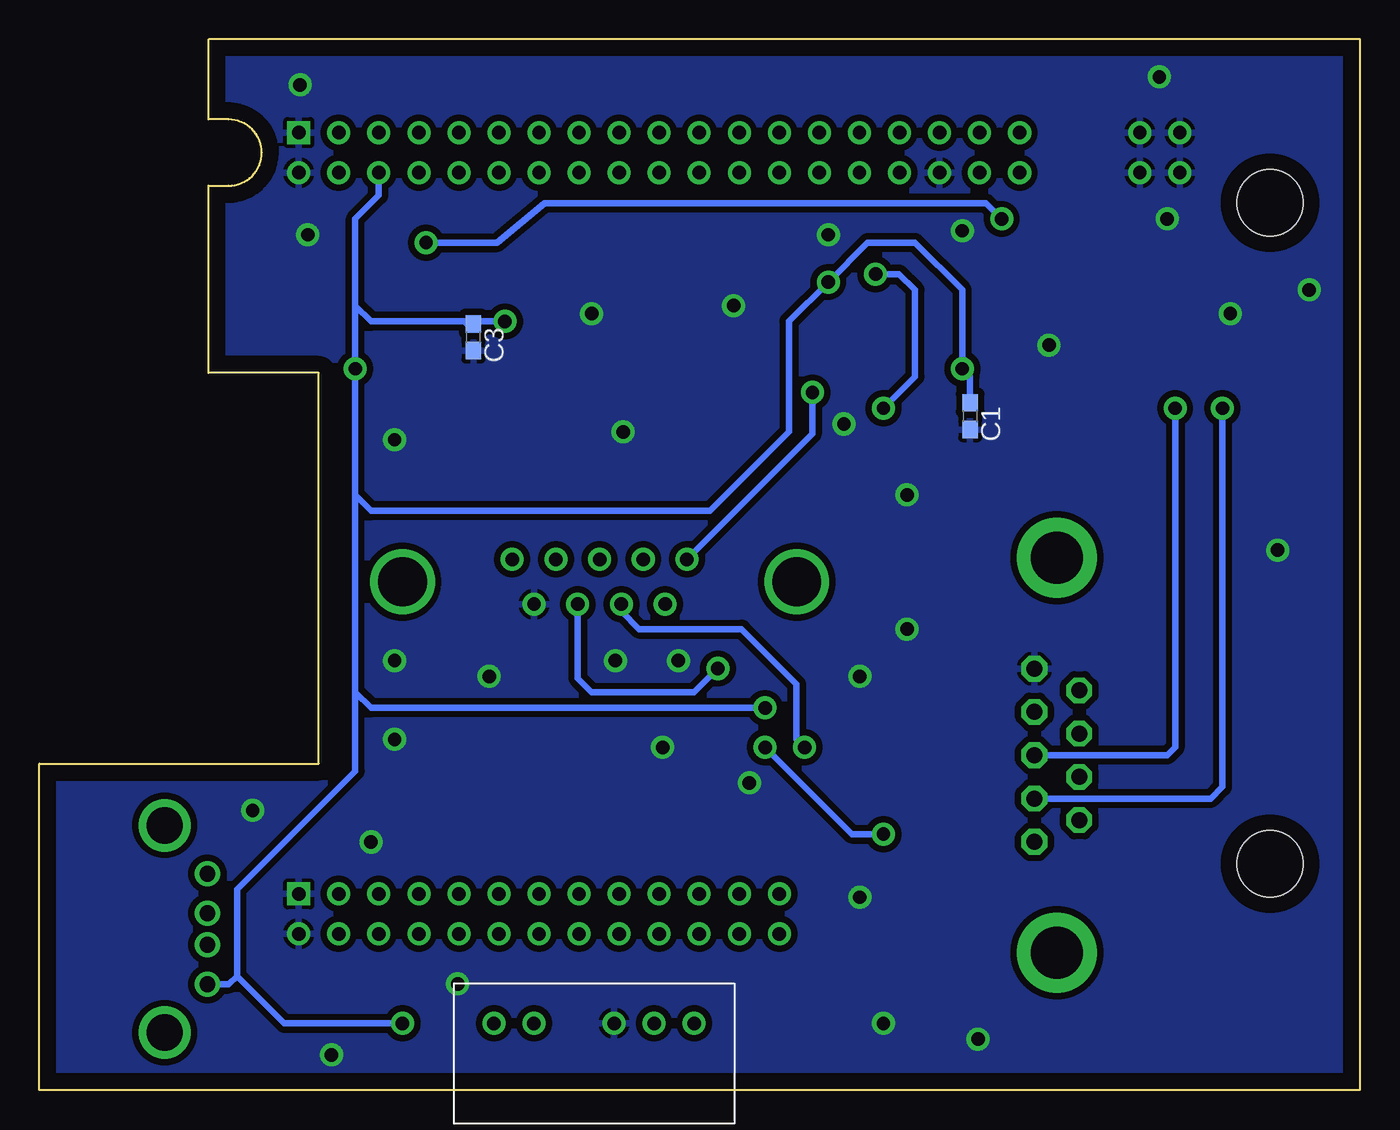
[diagram p8: board, bottom side, seen from below]

Size 83.75 x 66.61 mm. Coordinates in mm from the lower left corner, seen from the top.
Copper layers (1+16): Top 0.035mm / dielectric 1.5mm / Bottom 0.035mm
Design rules "fraese_lpkf": minimum track width 12mil, minimum drill 24mil, track to track 8mil, track to pad 8mil, pad to pad 8mil, via to via 12mil, smd to smd 8mil, copper to edge 40mil, drill to drill 8mil, minimum pad ring 12mil, minimum via ring 12mil, stop-mask expansion 4mil, vias tented up to drill 0mil, thermal gap 10mil

### Footprints (pad centres in the part's own frame; a part is rotated, then mirrored left to right if it is on the bottom)
C0603 = smd 1.1 x 1: 1 -0.85,0; 2 0.85,0
SOT23 = smd 1 x 1.4: 1 -0.95,-1.1; 2 0.95,-1.1; 3 0,1.1
SO14 = smd 0.6 x 2.2: 1 -3.81,-2.6; 2 -2.54,-2.6; 3 -1.27,-2.6; 4 0,-2.6; 5 1.27,-2.6; 6 2.54,-2.6; 7 3.81,-2.6; 8 3.81,2.6; 9 2.54,2.6; 10 1.27,2.6; 11 0,2.6; 12 -1.27,2.6; 13 -2.54,2.6; 14 -3.81,2.6
SO-08 = smd 0.6 x 2.2: 1 -1.905,-2.6; 2 -0.635,-2.6; 3 0.635,-2.6; 4 1.905,-2.6; 5 1.905,2.6; 6 0.635,2.6; 7 -0.635,2.6; 8 -1.905,2.6
SO16 = smd 0.66 x 2.032: 1 -4.445,-3.073; 2 -3.175,-3.073; 3 -1.905,-3.073; 4 -0.635,-3.073; 5 0.635,-3.073; 6 1.905,-3.073; 7 3.175,-3.073; 8 4.445,-3.073; 9 4.445,3.073; 10 3.175,3.073; 11 1.905,3.073; 12 0.635,3.073; 13 -0.635,3.073; 14 -1.905,3.073; 15 -3.175,3.073; 16 -4.445,3.073
R0805 = smd 1.3 x 1.5: 1 -0.95,0; 2 0.95,0
SIP = drill 0.85: 1 12.7,0; 2 10.16,0; 4 5.08,0; 5 2.54,0; 6 0,0
BEAGLEBONE_SHIELD = drill 0.85 square: 1 4.445,19.05; 47 52.705,19.05 | drill 0.85: 2 1.905,19.05; 3 4.445,21.59; 4 1.905,21.59; 5 4.445,24.13; 6 1.905,24.13; 7 4.445,26.67; 8 1.905,26.67; 9 4.445,29.21; 10 1.905,29.21; 11 4.445,31.75; 12 1.905,31.75; 13 4.445,34.29; 14 1.905,34.29; 15 4.445,36.83; 16 1.905,36.83; 17 4.445,39.37; 18 1.905,39.37; 19 4.445,41.91; 20 1.905,41.91; 21 4.445,44.45; 22 1.905,44.45; 23 4.445,46.99; 24 1.905,46.99; 25 4.445,49.53; 26 1.905,49.53; 48 50.165,19.05; 49 52.705,21.59; 50 50.165,21.59; 51 52.705,24.13; 52 50.165,24.13; 53 52.705,26.67; 54 50.165,26.67; 55 52.705,29.21; 56 50.165,29.21; 57 52.705,31.75; 58 50.165,31.75; 59 52.705,34.29; 60 50.165,34.29; 61 52.705,36.83; 62 50.165,36.83; 63 52.705,39.37; 64 50.165,39.37; 65 52.705,41.91; 66 50.165,41.91; 67 52.705,44.45; 68 50.165,44.45; 69 52.705,46.99; 70 50.165,46.99; 71 52.705,49.53; 72 50.165,49.53; 73 52.705,52.07; 74 50.165,52.07; 75 52.705,54.61; 76 50.165,54.61; 77 52.705,57.15; 78 50.165,57.15; 79 52.705,59.69; 80 50.165,59.69; 81 52.705,62.23; 82 50.165,62.23; 83 52.705,64.77; 84 50.165,64.77; 89 52.705,72.39; 90 50.165,72.39; 91 52.705,74.93; 92 50.165,74.93 | hole 4.2: 6.35,80.645; 48.26,80.645
F09VP = drill 1.016 octagon: 1 5.486,1.422; 2 2.743,1.422; 3 0,1.422; 4 -2.743,1.422; 5 -5.486,1.422; 6 4.115,-1.422; 7 1.372,-1.422; 8 -1.372,-1.422; 9 -4.115,-1.422 | drill 3.302 pad 5.08: G1 -12.522,0; G2 12.522,0
DSUB9 = drill 0.85: 1 -5.54,1.42; 2 -2.77,1.42; 3 0,1.42; 4 2.77,1.42; 5 5.54,1.42; 6 -4.155,-1.42; 7 -1.385,-1.42; 8 1.385,-1.42; 9 4.155,-1.42 | drill 3.1: P$10 -12.5,0; P$11 12.5,0
USB = drill 1: 1-VCC -3.5,2.71; 2-D+ 1,2.71; 2-D- -1,2.71; GND 3.5,2.71 | drill 2.3: P$1 -6.57,0; P$2 6.57,0

### Placement (x,y rotation side)
C1  24.73,42.73 270 bottom
C2  64.73,51.23 0 top
C3  56.23,47.73 270 bottom
C4  10.23,36.23 0 top
C5  6.73,37.23 0 top
C6  17.73,40.73 90 top
C7  43.23,41.98 180 top
C8  3.73,40.23 270 top
C9  25.23,39.73 0 top
C10  4.23,47.23 90 top
D1  60.73,44.73 90 top
D2  60.73,48.23 90 top
D3  36.73,51.73 180 top
D4  31.73,47.73 0 top
IC1  54.23,48.73 90 top
IC2  44.73,47.23 180 top
IC3  10.73,43.23 0 top
IC6  25.23,48.73 90 top
Q1  58.23,18.23 0 top
Q2  48.73,22.23 90 top
Q3  43.73,18.23 90 top
Q4  34.23,18.23 90 top
Q5  68.73,5.73 0 top
Q6  37.73,5.73 270 top
R1  10.73,50.23 270 top
R2  54.73,22.23 270 top
R3  52.23,22.23 270 top
R4  60.73,51.23 180 top
R5  62.73,53.73 180 top
R6  54.73,16.23 90 top
R7  52.23,16.23 90 top
R8  14.23,50.23 180 top
R9  54.73,42.73 0 top
R10  58.23,41.73 270 top
R11  40.23,45.73 270 top
R12  50.73,42.73 0 top
R13  50.73,40.23 180 top
R18  45.73,54.23 270 top
R19  43.23,54.23 270 top
R20  40.73,54.23 270 top
R26  24.73,42.23 0 top
R27  21.23,41.23 90 top
R28  34.73,47.73 270 top
R29  47.23,18.23 270 top
R30  37.73,16.23 90 top
R31  40.23,16.23 90 top
R32  49.73,16.23 90 top
R33  65.23,5.73 90 top
R34  60.73,6.73 0 top
R35  33.23,5.73 90 top
R36  30.23,7.73 270 top
R37  31.73,22.73 90 top
R38  41.23,24.23 180 top
R39  41.23,21.73 180 top
R40  29.23,19.23 180 top
U1  42.23,4.23 180 bottom
X1  86.36,8 90 top
X2  19.23,21.23 270 top
X4  48.23,32.23 0 top
X5  75.81,10.21 90 top

### Tracks (layer width: path | path; a pad name or v marks a point on that pad's centre or on a via)
+3V3
  Top 0.406: C7.1 44.1,42.45 IC2.6 44.1,46.59 44.73,47.23 45.73,47.23 46.64,48.14 IC2.1 46.64,50.64 47.73,51.73 47.73,54.23 49.73,56.23 63.73,56.23 64.77,57.27 X1.50 X1.49 64.73,60.75 64.73,61.73 63.73,62.73 55.73,62.73 53.73,64.73 18.23,64.73 16.73,63.23 16.73,54.23 15.73,53.23 8.73,53.23 6.23,50.73 6.23,46.73 6.29,46.28 | IC3.16 6.29,46.28 | 6.29,46.28 4.33,46.28 C10.1
+5V  (via drill 0.85)
  Top 0.406: D1.2 63.68,45.68 v63.73,45.73 | IC1.4 v54.23,48.73 | X1.51 X1.52 | R38.2 v37.73,24.23 37.18,23.68 R37.2 | IC6.4 26.23,48.73 25.23,47.73 v25.23,45.73 | v60.73,4.23 U1.1 | v33.73,51.23 34.18,51.23 D3.2
  Bottom 0.406: 63.73,49.73 v63.73,45.73 63.73,37.73 | 63.73,49.73 63.73,55.23 62.23,56.73 X1.52 | 63.73,49.73 62.73,48.73 IC1.4 | v54.23,48.73 IC1.4 | v37.73,24.23 62.73,24.23 63.73,25.23 | 63.73,25.23 63.73,37.73 | X5.1-VCC 71.75,6.72 71.23,7.23 | 71.23,7.23 71.23,12.73 63.73,20.23 63.73,25.23 | 63.73,37.73 62.73,36.73 41.23,36.73 36.23,41.73 36.23,48.73 v33.73,51.23 31.23,53.73 28.23,53.73 25.23,50.73 v25.23,45.73 24.73,45.23 C1.1 | 71.23,7.23 68.23,4.23 v60.73,4.23 | C3.1 56.68,48.58 IC1.4
+12V  (via drill 0.85)
  Top 0.406: R39.2 v37.73,21.73 | 28.28,17.18 R40.2 26.73,20.78 26.73,24.23 30.73,28.23 38.23,28.23 40.81,30.81 X4.6 | 28.28,17.18 29.23,16.23 v30.23,16.23 | U1.6 40.23,2.23 27.73,2.23 27.23,2.73 27.23,16.13 28.28,17.18
  Bottom 0.406: v37.73,21.73 32.23,16.23 v30.23,16.23
BB_AIN_E
  Top 0.406: C9.1 23.78,40.33 R26.1 23.73,42.18 R27.2 21.23,42.23 17.73,45.73 17.73,48.73 20.73,51.73 20.73,57.31 X1.84
BB_AIN_H  (via drill 0.85)
  Top 0.406: C2.1 R4.1 61.68,53.73 R5.2 v59.23,53.73 | X1.82 24.13,56.63 v22.73,55.23
  Bottom 0.406: v22.73,55.23 23.73,56.23 36.23,56.23 51.73,56.23 54.73,53.73 v59.23,53.73
BB_DOUT_DOWN
  Top 0.406: R31.1 45.68,15.28 46.99,13.97 X1.17
BB_DOUT_LEFT
  Top 0.406: X1.11 54.61,15.16 R6.1
BB_DOUT_RIGHT
  Top 0.406: X1.13 52.07,15.12 R7.1
BB_DOUT_UP
  Top 0.406: X1.15 49.53,15.08 R32.1
BB_SPI0_CS0
  Top 0.406: R18.1 45.73,59.45 X1.63
BB_SPI0_D0
  Top 0.406: X1.67 41.78,60.7 40.64,59.56 40.64,54.77 R20.1
BB_SPI0_SCLK
  Top 0.406: R19.1 43.23,56.84 X1.68
BB_UART4_RX
  Top 0.406: X1.57 54.61,61.85 52.73,63.73 19.23,63.73 17.73,62.23 17.73,53.23 16.73,52.23 11.78,52.23 R1.1
BB_UART4_TX
  Top 0.406: X1.59 52.07,61.89 51.23,62.73 19.73,62.73 18.73,61.73 18.73,52.23 16.73,50.23 R8.1
ELEVATION_ROTOR_INTERFACE_SUPPLY
  Top 0.406: R36.1 35.61,8.68 X1.26
GND  (via drill 0.85)
  other vias: 46.73,41.73 38.73,19.48 39.73,49.73 61.23,41.23 28.73,29.23 66.73,54.23 47.23,27.23 44.23,21.73 43.23,27.23 24.23,3.23 61.23,22.23 61.23,27.23 32.73,42.23 19.73,47.23 25.23,54.48 28.73,37.73 62.73,15.73 65.23,2.23 30.23,4.23 31.73,12.23 31.73,26.23 48.73,49.23 12.23,55.23 33.73,54.23 55.23,26.23 57.23,6.73 12.73,64.23 67.23,63.73 70.23,17.73 3.23,50.73 8.23,49.23 5.23,34.23
  pour Top (isolate 0.406): -6.35,76.69 93.98,76.69 93.98,-5.43 -6.35,-5.43
  pour Bottom (isolate 0.406): -4.58,72.92 91.94,72.92 91.44,-2.16 -5.08,-2.16
N$1
  Top 0.406: IC1.7 IC1.6 59.32,51.27 R4.2
N$2
  Top 0.406: IC1.12 49.46,47.46 48.73,46.73 47.73,45.72 IC2.8
N$3
  Top 0.406: IC1.14 51.68,44.87 R12.2 R9.1
N$5
  Top 0.406: IC1.13 50.19,46.19 49.73,45.73 49.73,42.78 R12.1 R13.2
N$6
  Top 0.406: IC2.2 45.37,52.92 R18.2
N$7
  Top 0.406: IC2.5 40.28,44.63 R11.2
N$9
  Top 0.406: IC2.4 42.83,50.14 40.73,52.23 R20.2
N$10
  Top 0.406: IC2.3 44.1,51.36 43.23,52.23 R19.2
N$11
  Top 0.406: R7.2 R3.2 Q2.1
N$12
  Top 0.406: IC1.5 58.46,50 59.73,48.73 59.73,48.23 59.63,48.33 D2.3 D1.3 58.23,43.33 R10.1
N$13
  Top 0.406: R2.2 R6.2 57.23,17.18 Q1.1
N$14
  Top 0.406: Q5.3 69.33,6.83 70.23,7.73 70.23,12.23 71.73,13.73 73.09,13.73 X5.GND
N$16
  Top 0.406: IC3.4 10.1,38.09 9.38,37.38 C4.1
N$17
  Top 0.406: IC3.5 11.37,36.52 C4.2
N$18
  Top 0.406: IC3.3 8.83,38.48 C5.2
N$19
  Top 0.406: IC3.1 6.29,38.78 5.73,38.23 5.73,37.38 C5.1
N$20
  Top 0.406: IC3.6 12.64,38.83 13.23,38.23 17.23,38.23 17.73,38.73 C6.1
N$21
  Top 0.406: C8.1 3.73,42.23 4.23,42.73 6.73,42.73 7.56,41.91 IC3.2
N$22
  Top 0.406: IC3.11 12.64,49.58 R8.2
N$23
  Top 0.406: R34.2 65.18,6.73 R33.2 66.28,6.68 66.73,6.23 66.73,5.68 Q5.1
N$25
  Top 0.406: IC3.12 11.37,48.64 R1.2
N$34
  Top 0.406: R36.2 30.33,6.68 R35.2 Q6.1
N$35  (via drill 0.85)
  Top 0.406: IC6.7 IC6.6 30.27,51.27 v30.73,51.73 | v30.23,43.23 29.23,42.23 R26.2
  Bottom 0.406: v30.23,43.23 28.23,45.23 28.23,50.73 29.23,51.73 v30.73,51.73
N$36
  Top 0.406: IC6.5 30.56,50 D4.3 31.88,48.68 R28.1 34.73,48.63 D3.3
N$37
  Top 0.406: U1.2 50.39,6.23 40.73,6.23 40.23,5.73 Q6.3
N$38
  Top 0.406: R32.2 47.33,17.18 R29.2 Q3.1
N$39
  Top 0.406: Q4.1 37.63,17.28 R30.2 R31.2
ROT_E_DOWN  (via drill 0.85 pad 0.85)
  Top 0.406: R40.1 31.73,19.23 | 31.73,19.23 32.13,19.23 Q4.3 | v35.23,21.73 31.78,21.73 R37.1 31.73,19.23
  Bottom 0.406: X4.7 46.85,30.34 45.73,29.23 39.23,29.23 35.73,25.73 35.73,22.23 v35.23,21.73
ROT_E_POSITION  (via drill 0.85)
  Top 0.406: R28.2 v34.73,44.23
  Bottom 0.406: v34.73,44.23 34.73,41.61 X4.1
ROT_E_UP  (via drill 0.85)
  Top 0.406: Q3.3 42.18,18.68 R39.1 R38.1 42.23,24.28 42.23,25.23 v40.73,26.73
  Bottom 0.406: X4.8 49.62,26.12 48.73,25.23 42.23,25.23 v40.73,26.73
ROT_H_LEFT
  Top 0.406: Q1.3 58.23,26.73 56.73,28.23 49.23,28.23 48.23,29.23 X4.3
ROT_H_POSITON
  Top 0.406: R10.2 58.23,38.11 X4.5
ROT_H_RIGHT
  Top 0.406: Q2.3 46.73,22.23 45.46,23.5 X4.2
ROT_H_SPEED
  Top 0.406: 55.73,42.68 R9.2 56.23,42.18 56.23,37.73 54.23,35.73 53.08,35.73 X4.4
ROTOR_AC_SUPPLY
  Top 0.406: X1.8 59.69,6.82 R34.1
RS232_RX  (via drill 0.85)
  Top 0.406: IC3.13 10.1,44.86 v11.73,43.23
  Bottom 0.406: v11.73,43.23 11.73,21.73 12.23,21.23 X2.3
RS232_TX  (via drill 0.85)
  Top 0.406: IC3.14 8.83,44.14 v8.73,43.23
  Bottom 0.406: v8.73,43.23 8.73,19.23 9.47,18.49 X2.2